# EAGLE design Energy Shield (EAGLE 6.3)
DESCRIPTION: microOBD 200 OBD-II Module; HW_REV: 1.4; PCB_REV: C; PCB_SPEC1: Layer Count: 4; PCB_SPEC2: Size: 1.3" x 0.59"; PCB_SPEC3: Finish Thickness: 0.049" - 0.052"; PCB_SPEC4: Copper Weight: 1oz; TITLE: STM1120
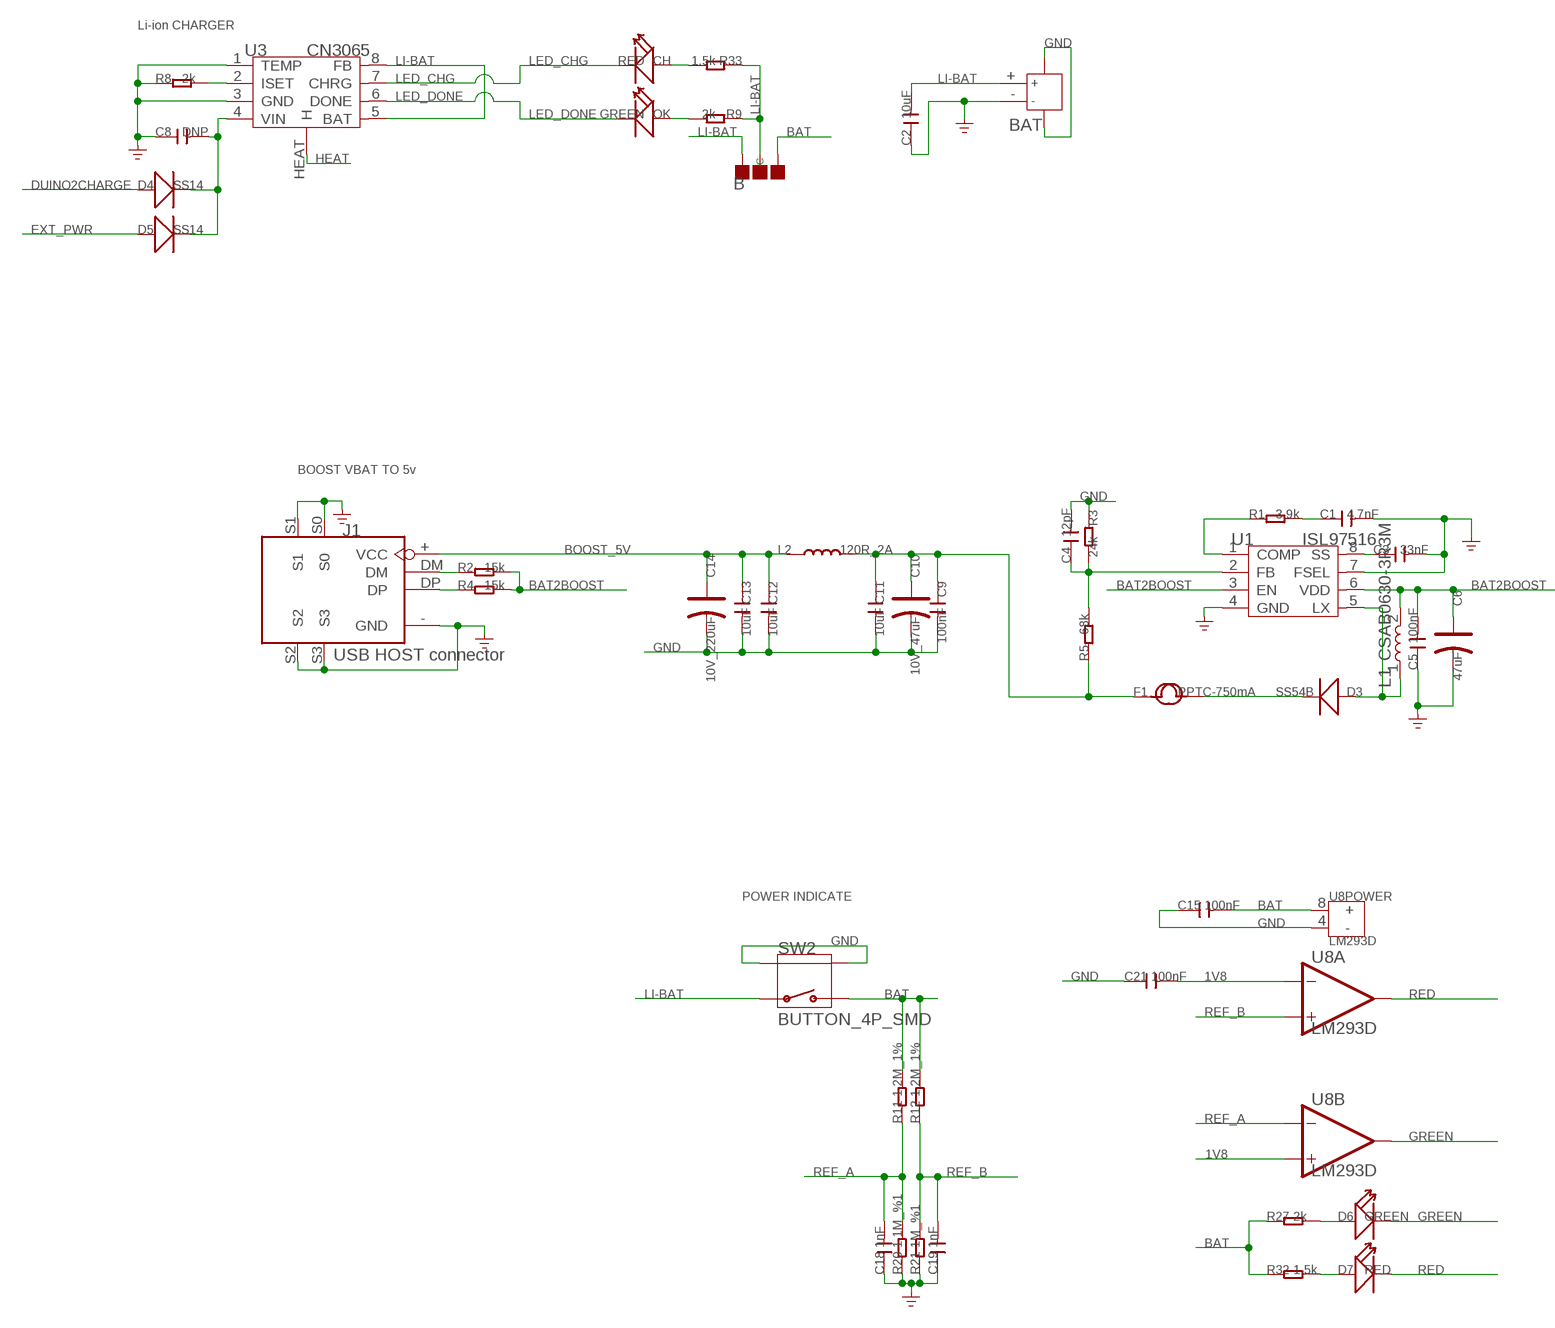
[diagram p0: schematic, sheet 1, part 1 of 2]
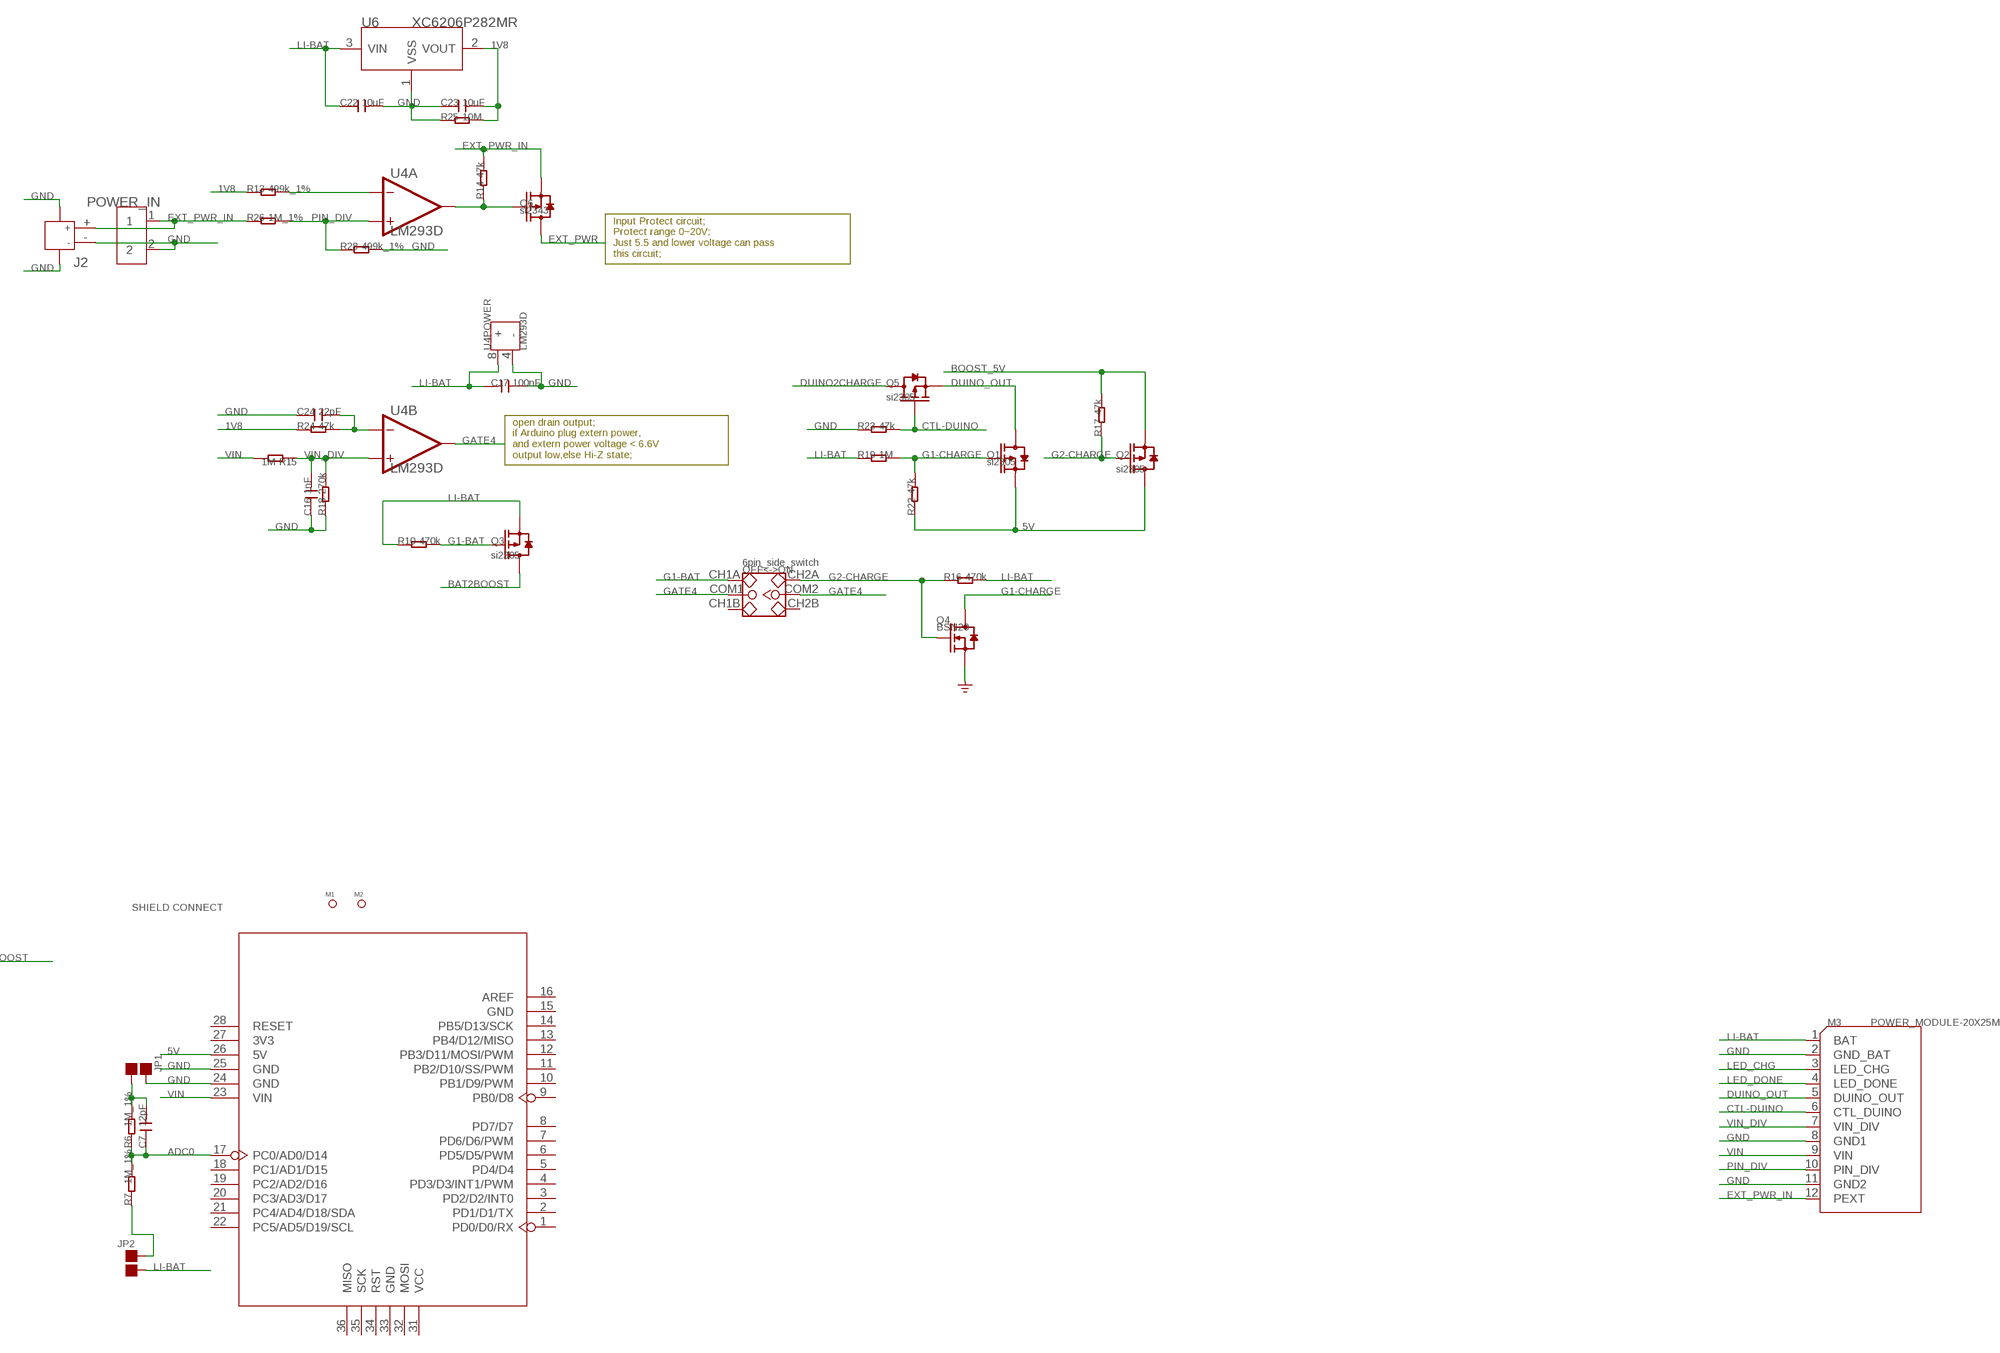
[diagram p1: schematic, sheet 1, part 2 of 2]

## Parts
B  PAD-JUMPER-3P-40*40  [3P-SMD-4.1X1.5]
BAT  JACK-JST-2P-SMD-PW'2.0'  [JST-SMD-2.0-90D]
C1  4.7nF  C-0603  [C0603]
C2  10uF  C-0805  [C0805]
C3  33nF  C-0603  [C0603]
C4  12pF  C-0603  [C0603]
C5  100nF  C-0603  [C0603]
C6  47uF  CAP-AVX-B  [AVX-B]
C7  12pF  C-0603  [C0603]
C8  DNP  C-0805  [C0805]
C9  100nF  C-0603  [C0603]
C10  10V_47uF  CAP-AVX-B  [AVX-B]
C11  10uF  C-0805  [C0805]
C12  10uF  C-0805  [C0805]
C13  10uF  C-0805  [C0805]
C14  10V_220uF  CAP-AVX-D  [AVX-D]
C15  100nF  C-0603  [C0603]
C16  1nF  C-0603  [C0603]
C17  100nF  C-0603  [C0603]
C18  1nF  C-0603  [C0603]
C19  1nF  C-0603  [C0603]
C21  100nF  C-0603  [C0603]
C22  10uF  C-0805  [C0805]
C23  10uF  C-0805  [C0805]
C24  22pF  C-0603  [C0603]
CH  RED  LED'RIGHT'  [LED-SIDE-VIEW-0603-RIGHT]
D3  SS54B  D'MBRS240LT3'  [SMB]
D4  SS14  D'SMA'  [D2010]
D5  SS14  D'SMA'  [D2010]
D6  GREEN  LED'RIGHT'  [LED-SIDE-VIEW-0603-RIGHT]
D7  RED  LED'RIGHT'  [LED-SIDE-VIEW-0603-RIGHT]
F1  PPTC-750mA  FUSE'1210'  [F1210]
J1  USB HOST connector  USB-FEMALE-13.2X14.5  [FEMALE-14.5X13.2]
J2  JACK-JST-2P-SMD-PW'2.0'  [JST-SMD-2.0-90D]
JP1  PAD-JUMPER-2P  [2P-SMD-1.78X1.27]
JP2  PAD-JUMPER-2P  [2P-SMD-1.78X1.27]
L1  CSAB0630-3R3M  L  [L0630]
L2  120R_2A  L'0805'  [L0805]
M1  PAD-MARK  [ROUND-MARK-1.0]
M2  PAD-MARK  [ROUND-MARK-1.0]
M3  POWER_MODULE-20X25MM  [POWER_MODULE]
OFF<->ON  6pin_side_switch  SWITCH-2CH-6P'90D'  [6P-2CH-2.5-9.1X3.5X3.2H-90D]
OK  GREEN  LED'RIGHT'  [LED-SIDE-VIEW-0603-RIGHT]
POWER_IN  SCREW-TERMINAL-2P'3.5'  [2P-3.5]
Q1  si2305  MOSFET-P'SI2323CDS/SI2305DS<BR>'  [SOT23]
Q2  si2305  MOSFET-P'SI2323CDS/SI2305DS<BR>'  [SOT23]
Q3  si2305  MOSFET-P'SI2323CDS/SI2305DS<BR>'  [SOT23]
Q4  BSN20  MOSFET-N'SOT23'  [SOT23]
Q5  si2305  MOSFET-P'SI2323CDS/SI2305DS<BR>'  [SOT23]
Q6  si2343  MOSFET-P'SI2323CDS/SI2305DS<BR>'  [SOT23]
R1  3.9k  R-0603  [R0603]
R2  15k  R-0603  [R0603]
R3  24k  R-0603  [R0603]
R4  15k  R-0603  [R0603]
R5  68k  R-0603  [R0603]
R6  1M_1%  R-0603  [R0603]
R7  1M_1%  R-0603  [R0603]
R8  2k  R-0603  [R0603]
R9  2k  R-0603  [R0603]
R10  470k  R-0603  [R0603]
R11  1.2M_1%  R-0603  [R0603]
R12  1.2M_1%  R-0603  [R0603]
R13  499k_1%  R-0603  [R0603]
R14  47k  R-0603  [R0603]
R15  1M  R-0603  [R0603]
R16  470k  R-0603  [R0603]
R17  47k  R-0603  [R0603]
R18  270k  R-0603  [R0603]
R19  1M  R-0603  [R0603]
R20  1.1M_%1  R-0603  [R0603]
R21  1M_%1  R-0603  [R0603]
R22  47k  R-0603  [R0603]
R23  47k  R-0603  [R0603]
R24  47k  R-0603  [R0603]
R25  10M  R-0603  [R0603]
R26  1M_1%  R-0603  [R0603]
R27  2k  R-0603  [R0603]
R28  499k_1%  R-0603  [R0603]
R32  1.5k  R-0603  [R0603]
R33  1.5k  R-0603  [R0603]
SW2  BUTTON_4P_SMD  [4P-SMD-7X3.5X3.5]
U1  ISL97516  ISL97516-MSOP8  [MSOP8]
U2  ARDUINO'W/O-SILK'  [ARDUINO-W/O-SILK]
U3  CN3065  CN3065-DFN8  [DFN8]
U4  LM293D  LMX93D  [SOIC8-6.0]
U6  XC6206P282MR  XC6206MR  [SOT23]
U8  LM293D  LMX93D  [SOIC8-6.0]

## Nets
1V8: C21.2 C23.2 R13.1 R24.1 R25.2 U6.2(VOUT) U8.2(A:IN-) U8.5(B:IN+)
5V: Q1.2(S) Q2.3(D) R22.1 U2.26(5V)
ADC0: C7.1 R6.1 R7.2 U2.17(PC0/AD0/D14)
BAT: B.00(L) C15.2 R11.2 R12.2 R27.1 R32.1 SW2.2 U8.8(POWER:+)
BAT2BOOST: C5.2 C6.+ L1.2 Q3.3(D) R2.2 R4.2 U1.3(EN) U1.6(VDD)
BOOST_5V: C12.1 C13.1 C14.+ J1.+(VCC) L2.1 Q2.2(S) R17.2
CTL-DUINO: M3.6(CTL_DUINO) Q5.1(G) R23.2
DUINO2CHARGE: D4.+ Q5.3(D)
DUINO_OUT: M3.5(DUINO_OUT) Q1.3(D) Q5.2(S)
EXT_PWR: D5.+ Q6.3(D)
EXT_PWR_IN: J2.+ M3.12(PEXT) POWER_IN.1 Q6.2(S) R14.2 R26.1
G1-BAT: OFF<->ON.CH1A Q3.1(G) R10.2
G1-CHARGE: Q1.1(G) Q4.3(D) R19.2 R22.2
G2-CHARGE: OFF<->ON.CH2A Q2.1(G) Q4.1(G) R16.1 R17.1
GATE4: OFF<->ON.COM1 OFF<->ON.COM2 U4.7(B:OUT)
GND: BAT.3 BAT.4 BAT.- C1.2 C2.1 C3.2 C4.2 C5.1 C6.- C8.1 C9.2 C10.- C11.2 C12.2 C13.2 C14.- C15.1 C16.1 C17.1 C18.1 C19.1 C21.1 C22.2 C23.1 C24.1 J1.-(GND) J1.S0 J1.S1 J1.S2 J1.S3 J2.3 J2.4 J2.- JP1.2 M3.2(GND_BAT) M3.8(GND1) M3.11(GND2) POWER_IN.2 Q4.2(S) R3.1 R8.1 R18.1 R20.1 R21.1 R23.1 R25.1 R28.2 SW2.S1 SW2.S2 U1.4(GND) U1.7(FSEL) U2.24(GND) U2.25(GND) U3.1(TEMP) U3.3(GND) U4.4(POWER:-) U6.1(VSS) U8.4(POWER:-)
GREEN: D6.2(-) U8.7(B:OUT)
HEAT: U3.HEAT(H)
LED_CHG: CH.2(-) M3.3(LED_CHG) U3.7(CHRG)
LED_DONE: M3.4(LED_DONE) OK.2(-) U3.6(DONE)
LI-BAT: B.11(R) B.MM(C) BAT.+ C2.2 C17.2 C22.1 JP2.1 M3.1(BAT) Q3.2(S) R9.1 R10.1 R16.2 R19.1 R33.1 SW2.1 U3.5(BAT) U3.8(FB) U4.8(POWER:+) U6.3(VIN)
N$1: R1.1 U1.1(COMP)
N$2: C1.1 R1.2
N$3: C4.1 R3.2 R5.2 U1.2(FB)
N$4: D3.+ L1.1 U1.5(LX)
N$5: C9.1 C10.+ C11.1 F1.1 L2.2 R5.1
N$6: C3.1 U1.8(SS)
N$7: R8.2 U3.2(ISET)
N$8: Q6.1(G) R14.1 U4.1(A:OUT)
N$9: D6.1(+) R27.2
N$10: OK.1(+) R9.2
N$11: D7.1(+) R32.2
N$12: R13.2 U4.2(A:IN-)
N$13: CH.1(+) R33.2
N$15: J1.DM R2.1
N$16: J1.DP R4.1
N$17: D3.- F1.2
N$22: JP2.2 R7.1
N$27: C7.2 JP1.1 R6.2
P$1: C24.2 R24.2 U4.6(B:IN-)
PIN_DIV: M3.10(PIN_DIV) R26.2 R28.1 U4.3(A:IN+)
RED: D7.2(-) U8.1(A:OUT)
REF_A: C18.2 R11.1 R20.2 U8.6(B:IN-)
REF_B: C19.2 R12.1 R21.2 U8.3(A:IN+)
VCHG_IN: C8.2 D4.- D5.- U3.4(VIN)
VIN: M3.9(VIN) R15.2 U2.23(VIN)
VIN_DIV: C16.2 M3.7(VIN_DIV) R15.1 R18.2 U4.5(B:IN+)
Unconnected: OFF<->ON.CH1B OFF<->ON.CH2B U2.1(PD0/D0/RX) U2.2(PD1/D1/TX) U2.3(PD2/D2/INT0) U2.4(PD3/D3/INT1/PWM) U2.5(PD4/D4) U2.6(PD5/D5/PWM) U2.7(PD6/D6/PWM) U2.8(PD7/D7) U2.9(PB0/D8) U2.10(PB1/D9/PWM) U2.11(PB2/D10/SS/PWM) U2.12(PB3/D11/MOSI/PWM) U2.13(PB4/D12/MISO) U2.14(PB5/D13/SCK) U2.15(GND) U2.16(AREF) U2.18(PC1/AD1/D15) U2.19(PC2/AD2/D16) U2.20(PC3/AD3/D17) U2.21(PC4/AD4/D18/SDA) U2.22(PC5/AD5/D19/SCL) U2.27(3V3) U2.28(RESET) U2.31(VCC) U2.32(MOSI) U2.33(GND) U2.34(RST) U2.35(SCK) U2.36(MISO)

## Notes on the sheet
- Input Protect circuit;
  Protect range 0~20V;
  Just 5.5 and lower voltage can pass
  this circuit;
- open drain output;
  if Arduino plug extern power,
  and extern power voltage < 6.6V
  output low,else Hi-Z state;
- Li-ion CHARGER
- BOOST VBAT TO 5v
- SHIELD CONNECT
- POWER INDICATE

## Library data of the parts
B = Discrete:PAD-JUMPER-3P; PARTNO: DNP
BAT J2 = Connector:JACK-JST-2P-SMD-PW
C1-C5 C7-C9 C11-C13 C15-C19 C21-C24 = Discrete:C*: Ceramic Capacitors
C6 C10 C14 = Discrete:CAP*: Electrolytic Capacitors,Tantalum Capacitors and Super Capacitors
CH D6 D7 OK = Discrete:LED*
D3-D5 = Discrete:D*
F1 = Discrete:FUSE
J1 = Connector:USB-FEMALE
JP1 JP2 = Discrete:PAD-JUMPER-2P; PARTNO: DNP
L1 = template:L*
L2 = Discrete:L*
M1 M2 = Discrete:PAD-MARK; PARTNO: DNP
M3 = For_Test_Albert_v6:POWER_MODULE
OFF<->ON = Discrete:SWITCH-2CH-6P
POWER_IN = Connector:SCREW-TERMINAL-2P
Q1-Q3 Q5 Q6 = Discrete:MOSFET-P
Q4 = Discrete:MOSFET-N: IRLL014: http://www.vishay.com/docs/91319/sihll014.pdf
R1-R28 R32 R33 = Discrete:R*
SW2 = For_Test_Albert_v6:BUTTON_4P_SMD: TS-1188E http://www.best-dz.com/?thread-374-2.html
U1 = IC:ISL97516: 600kHz/1.2MHz PWM Step-Up Regulator http://www.intersil.com/data/fn/fn9261.pdf
U2 = moudle:ARDUINO
U3 = IC:CN3065: USB-Compatible Lithiumt-Ion Battery Charger with Thermal Regulation http://www.consonance-elec.com/pdf/%E6%8A%80%E6%9C%AF%E8%AF%B4%E6%98%8E%E4%B9%A6/DSC-CN3065.pdf
U4 U8 = For_Test_Albert_v6:LMX93: Dual Differential Comparator
U6 = IC:XC6206: LOW ESR Cap.Compatible Positive Voltage Regulators

## Net classes
0 default: width 0.203 mm, drill 0.305 mm, clearance 0.203 mm

## Board
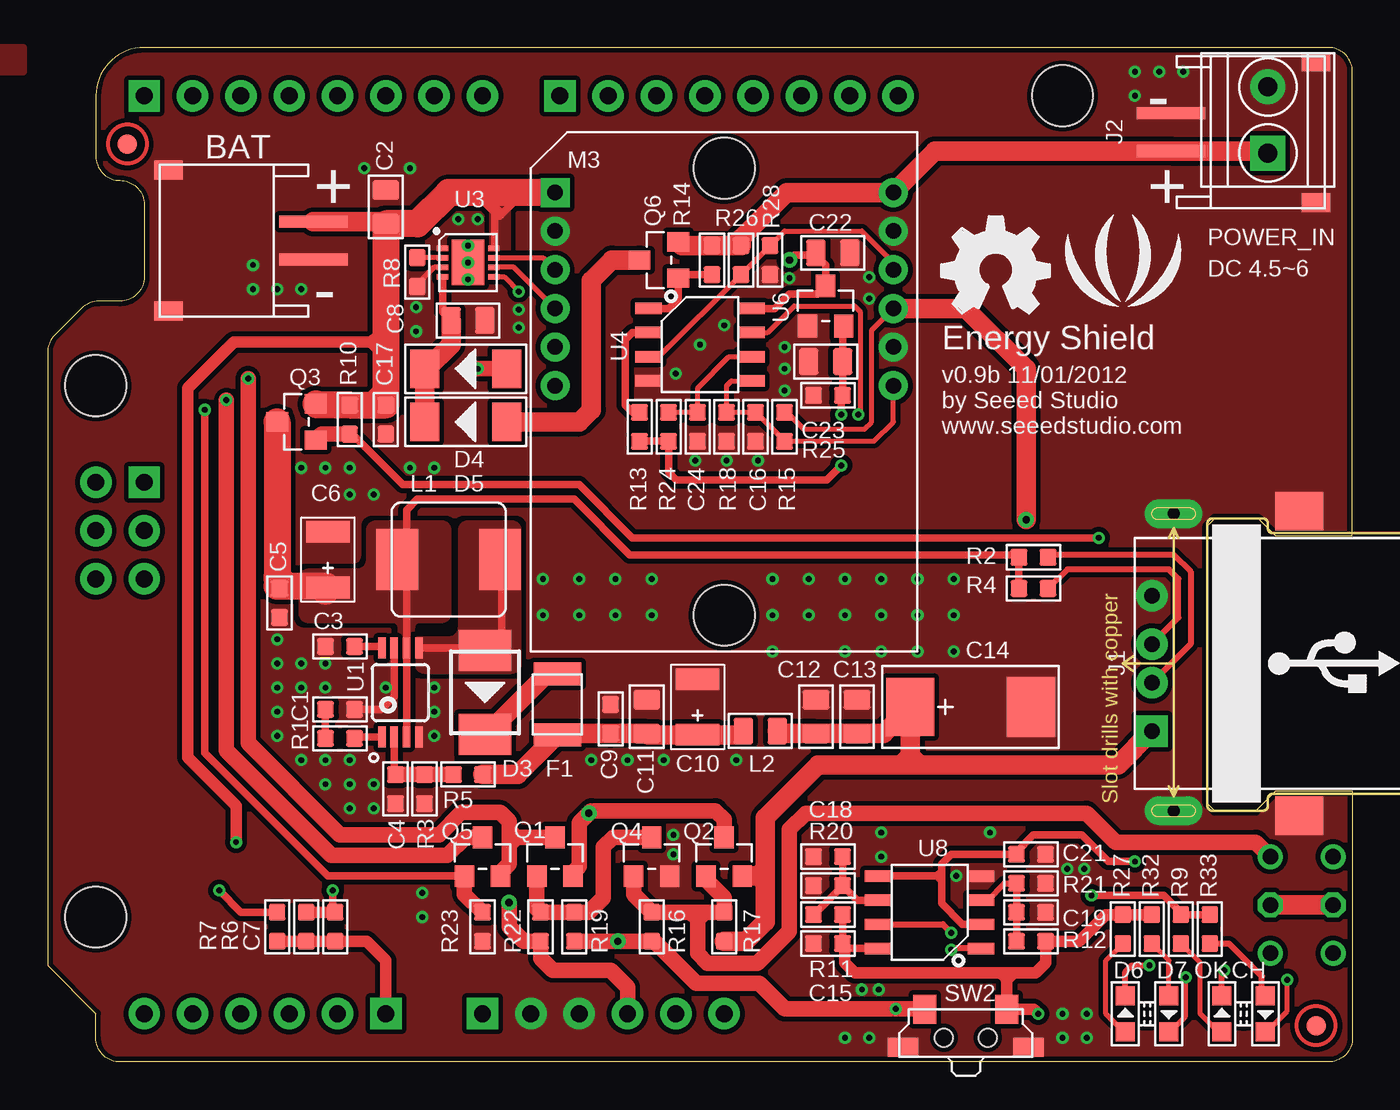
[diagram p2: board, top side]
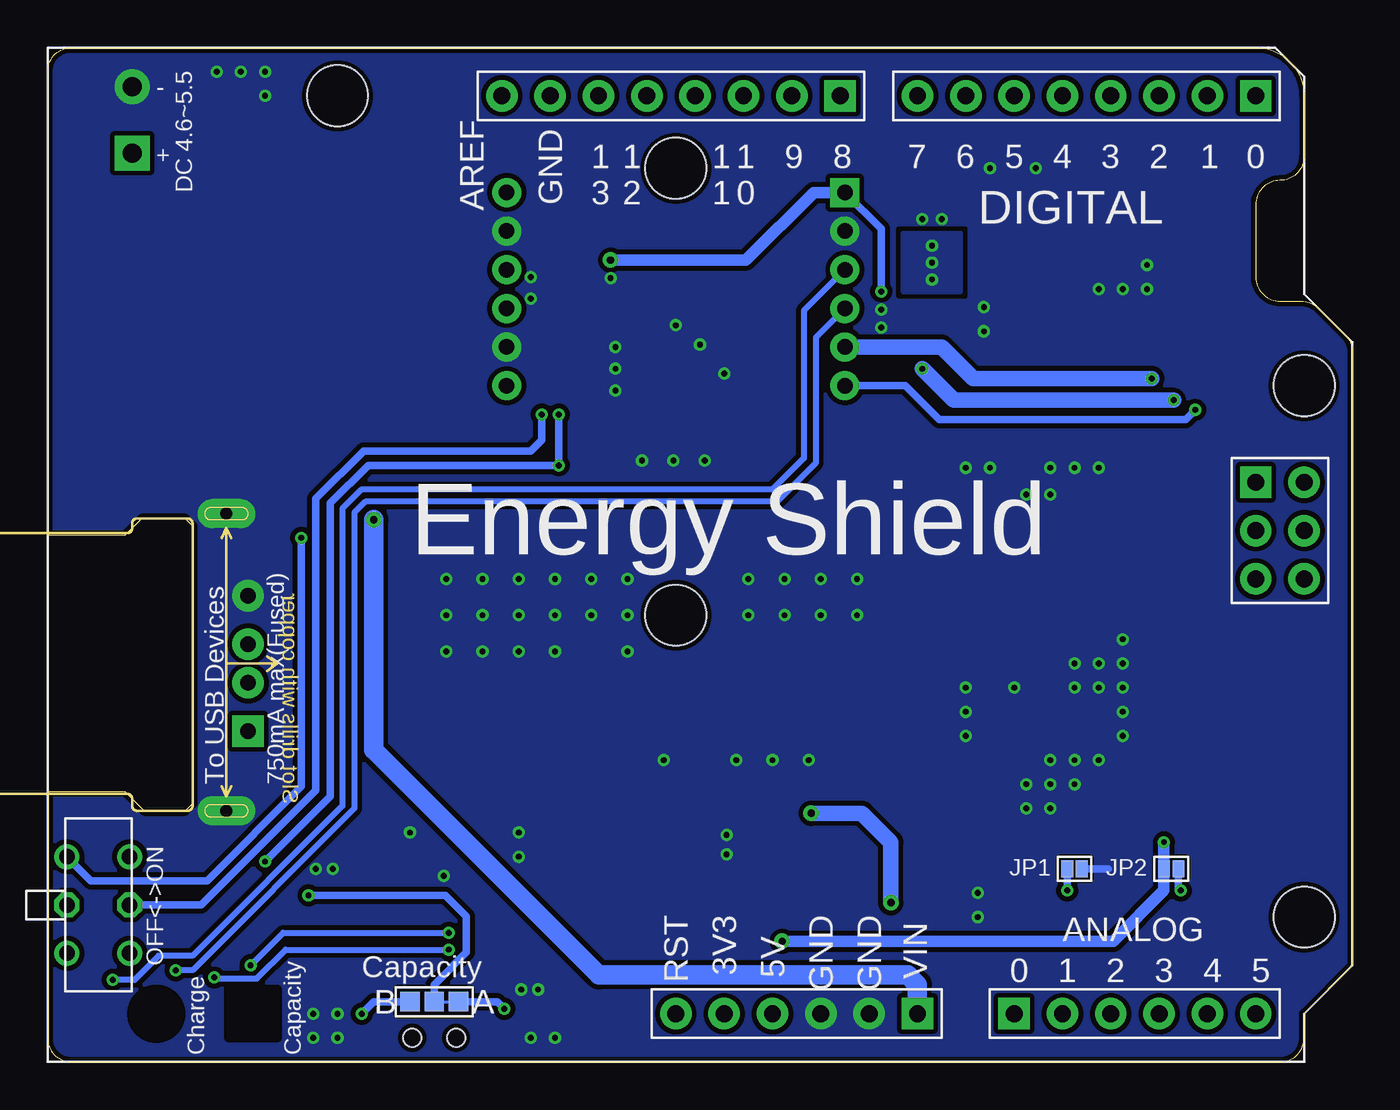
[diagram p3: board, bottom side, seen from below]

Size 68.58 x 53.34 mm. Coordinates in mm from the lower left corner, seen from the top.
Outline: 67.31,0 3.81,0 arc-90 2.54,1.27 2.54,2.54 0,5.08 0,37.32 arc-45 0.37,38.22 1.79,39.63 arc-45 2.69,40.01 3.81,40.01 arc90 5.08,41.27 5.08,45.09 arc90 3.81,46.35 arc-90 2.54,47.62 2.54,50.8 arc-90 5.08,53.34 67.31,53.34 arc-90 68.58,52.07 68.58,27.69 64.52,27.69 63.63,28.57 61.34,28.57 60.96,28.19 60.96,13.59 61.34,13.21 63.5,13.21 64.52,14.22 68.58,14.22 68.58,1.27 arc-90 67.31,0
Copper layers (1*16): Top 0.035mm / dielectric 1.5mm / Bottom 0.035mm
Design rules "default": minimum track width 6mil, minimum drill 12mil, track to track 6mil, track to pad 6mil, pad to pad 6mil, via to via 6mil, smd to smd 0mil, copper to edge 10mil, drill to drill 10mil, minimum pad ring 10mil, minimum via ring 6mil, stop-mask expansion 2mil, vias tented up to drill 100mil, thermal gap 10mil
tKeepout: 8 lines
tRestrict: area 57.1,1.9 to 58.4,3.2; area 62.2,1.9 to 63.5,3.2
bRestrict: area 56.5,1.3 to 59.1,3.8; area 61.6,1.3 to 64.1,3.8

### Footprints (pad centres in the part's own frame; a part is rotated, then mirrored left to right if it is on the bottom)
3P-SMD-4.1X1.5 = smd 1.016 x 1.016: 00 -1.27,0; 11 1.27,0; MM 0,0
JST-SMD-2.0-90D = smd 1 x 1.5: 3 3.7,-2.54; 4 -3.7,-2.54 | smd 0.635 x 3.6: + -1,5.08; - 1,5.08
C0603 = smd 0.889 x 0.889: 1 -0.762,0; 2 0.762,0
C0805 = smd 1.016 x 1.397: 1 -0.889,0; 2 0.889,0
AVX-B = smd 1.143 x 2.286: + -1.46,0; - 1.46,0
AVX-D = smd 2.54 x 3.048: + -3.175,0 | smd 2.54 x 3.175: - 3.175,0
LED-SIDE-VIEW-0603-RIGHT = smd 1 x 1: 1 0,-0.95; 2 0,0.95
SMB = smd 2.159 x 2.743: + -2.21,0; - 2.21,0
D2010 = smd 1.524 x 2.032: + -2.159,0; - 2.159,0
F1210 = smd 1.2 x 2.5: 1 -1.6,0; 2 1.6,0
FEMALE-14.5X13.2 = drill 0.813 pad 1.651 square: + 0.889,-3.556 | drill 0.813 pad 1.651: - 0.889,3.556; DM 0.889,-1.016; DP 0.889,1.016 | smd 2.54 x 2.032: S0 8.636,8.001; S3 8.636,-8.001 | drill 0.635 pad 1.524 long: S1 2.032,7.874; S2 2.032,-7.747
2P-SMD-1.78X1.27 = smd 0.889 x 0.61: 1 0,0.381; 2 0,-0.381
L0630 = smd 2.2 x 3.2: 1 -2.7,0; 2 2.7,0
L0805 = smd 1.016 x 1.397: 1 -0.889,0; 2 0.889,0
ROUND-MARK-1.0 = smd 1.016 x 1.016: P$1 0,0
POWER_MODULE = drill 0.813 pad 1.524 square: 1 -10.795,-8.89 | drill 0.813 pad 1.524: 2 -8.763,-8.89; 3 -6.731,-8.89; 4 -4.699,-8.89; 5 -2.667,-8.89; 6 -0.635,-8.89; 7 -0.635,8.89; 8 -2.667,8.89; 9 -4.699,8.89; 10 -6.731,8.89; 11 -8.763,8.89; 12 -10.795,8.89 | hole 3.2: -12.065,0; 11.43,0
6P-2CH-2.5-9.1X3.5X3.2H-90D = drill 0.813 pad 1.27: CH1A -2.54,-1.65; CH1B 2.54,-1.65; CH2A -2.54,1.65; CH2B 2.54,1.65 | drill 0.813 pad 1.27 octagon: COM1 0,-1.65; COM2 0,1.65
2P-3.5 = drill 1 pad 1.85 square: 1 -1.75,0 | drill 1 pad 1.85: 2 1.75,0
SOT23 = smd 1.016 x 1.143: 1 -0.95,-1.016; 2 0.95,-1.016; 3 0,1.016
R0603 = smd 0.889 x 0.889: 1 -0.762,0; 2 0.762,0
4P-SMD-7X3.5X3.5 = smd 1.2 x 1.5: 1 -2.15,1.5; 2 2.15,1.5 | smd 1.6 x 1: S1 -3.3,-0.5; S2 3.3,-0.5 | hole 0.95: -1.15,0; 1.15,0
MSOP8 = smd 0.4 x 1.1: 1 -0.975,-2.35; 2 -0.325,-2.35; 3 0.325,-2.35; 4 0.975,-2.35; 5 0.975,2.35; 6 0.325,2.35; 7 -0.325,2.35; 8 -0.975,2.35
ARDUINO-W/O-SILK = drill 0.889 pad 1.651 square: 1 63.5,50.8; 9 41.656,50.8; 17 50.8,2.54; 23 45.72,2.54; 36 63.5,30.48 | drill 0.889 pad 1.651: 2 60.96,50.8; 3 58.42,50.8; 4 55.88,50.8; 5 53.34,50.8; 6 50.8,50.8; 7 48.26,50.8; 8 45.72,50.8; 10 39.116,50.8; 11 36.576,50.8; 12 34.036,50.8; 13 31.496,50.8; 14 28.956,50.8; 15 26.416,50.8; 16 23.876,50.8; 18 53.34,2.54; 19 55.88,2.54; 20 58.42,2.54; 21 60.96,2.54; 22 63.5,2.54; 24 43.18,2.54; 25 40.64,2.54; 26 38.1,2.54; 27 35.56,2.54; 28 33.02,2.54; 31 66.04,30.48; 32 66.04,27.94; 33 66.04,25.4; 34 63.5,25.4; 35 63.5,27.94 | hole 3.2: 15.24,50.8; 66.04,35.56; 66.04,7.62
DFN8 = smd 0.3 x 0.6: 1 -0.75,-1.35; 2 -0.25,-1.35; 3 0.25,-1.35; 4 0.75,-1.35; 5 0.75,1.35; 6 0.25,1.35; 7 -0.25,1.35; 8 -0.75,1.35 | smd 2.4 x 1.7: HEAT 0,0
SOIC8-6.0 = smd 0.6 x 1.4: 1 -1.905,-2.7; 2 -0.635,-2.7; 3 0.635,-2.7; 4 1.905,-2.7; 5 1.905,2.7; 6 0.635,2.7; 7 -0.635,2.7; 8 -1.905,2.7
SOT23' = smd 1.016 x 1.2: 1 -0.95,-1.06; 2 0.95,-1.06; 3 0,1.06

### Placement (x,y rotation side)
B  48.26,3.17 0 bottom
BAT  8.89,43.18 270 top
C1  15.37,18.54 0 top
C2  17.78,44.96 270 top
C3  15.37,21.84 180 top
C4  18.29,14.35 270 top
C5  12.19,24.13 90 top
C6  14.73,26.42 90 top
C7  15.11,7.11 90 top
C8  22.1,38.99 180 top
C9  29.59,18.03 90 top
C10  34.16,18.67 90 top
C11  31.5,18.16 90 top
C12  40.39,18.16 90 top
C13  42.55,18.16 90 top
C14  48.51,18.67 0 top
C15  41.02,6.22 0 top
C16  37.21,33.4 90 top
C17  17.78,33.78 90 top
C18  41.02,10.79 0 top
C19  51.69,7.87 180 top
C21  51.69,10.92 180 top
C22  41.27,42.55 0 top
C23  40.89,36.83 0 top
C24  34.16,33.4 90 top
CH  64.01,2.54 180 top
D3  22.99,19.43 270 top
D4  21.97,36.45 180 top
D5  21.97,33.66 180 top
D6  56.64,2.54 0 top
D7  58.93,2.54 180 top
F1  26.8,18.8 90 top
J1  57.15,20.95 0 top
J2  64.14,48.9 90 top
JP1  14.61,10.16 90 bottom
JP2  9.53,10.16 90 bottom
L1  21.08,26.42 180 top
L2  37.47,17.4 180 top
M1  4.19,48.26 0 top
M2  66.67,1.91 0 top
M3  35.56,34.92 270 top
OFF<->ON  65.91,8.26 270 bottom
OK  61.72,2.54 0 top
POWER_IN  64.14,49.53 90 top
Q1  26.67,10.79 0 top
Q2  35.56,10.79 0 top
Q3  13.08,33.66 90 top
Q4  31.75,10.79 0 top
Q5  22.86,10.79 0 top
Q6  32.13,42.16 90 top
R1  15.37,17.02 180 top
R2  51.82,26.54 180 top
R3  19.81,14.35 90 top
R4  51.82,24.89 180 top
R5  22.1,15.11 180 top
R6  13.59,7.11 90 top
R7  12.06,7.11 270 top
R8  19.43,41.53 90 top
R9  59.56,6.99 270 top
R10  15.88,33.78 270 top
R11  41.02,7.75 0 top
R12  51.69,6.35 0 top
R13  31.11,33.4 90 top
R14  34.92,42.16 90 top
R15  38.73,33.4 90 top
R16  31.75,7.11 270 top
R17  35.56,7.11 270 top
R18  35.69,33.4 90 top
R19  27.69,7.11 90 top
R20  41.02,9.27 0 top
R21  51.69,9.4 180 top
R22  25.91,7.11 90 top
R23  22.86,7.11 90 top
R24  32.64,33.4 90 top
R25  41.02,35.05 0 top
R26  36.45,42.16 270 top
R27  56.52,6.99 270 top
R28  37.97,42.16 270 top
R32  58.04,6.99 270 top
R33  61.09,6.99 270 top
SW2  48.26,1.27 0 top
U1  18.54,19.43 0 top
U2  68.58,0 0 bottom
U3  22.1,42.04 270 top
U4  34.29,37.72 270 top
U6  XC6206P282MR  [SOT23']  40.89,39.75 0 top
U8  46.35,7.87 90 top
U$17  [OSHW_FILLX200_NOTEXT]  46.99,39.37 0 top
U$18  [LOGO_SILK]  56.52,41.4 0 top

### Tracks (layer width: path | path; a pad name or v marks a point on that pad's centre or on a via)
1V8  (via drill 0.3 pad 0.64)
  Top 0.406: U8.2 48.08,7.24 46.99,8.33 46.99,9.53 | R13.1 R24.1 32.64,31.01 33.04,30.61 40.96,30.61 v41.72,31.37 | 46.99,9.53 46.99,9.65 | 46.99,9.65 46.99,10.03 | 46.99,10.03 46.99,10.41 47.5,10.92 C21.2 50.93,11.05 51.82,11.94 54.36,11.94 55.75,10.54 v57.15,10.54 | U8.5 46.74,9.78 | 46.74,9.78 46.86,9.78 46.99,9.65 | 46.74,9.78 46.99,10.03 | 46.74,9.78 46.99,9.53 | U6.2 41.78,38.63 C23.2 R25.2 41.72,34.99 v41.72,34.04
  Bottom 0.406: v41.72,34.04 v41.72,31.37 51.74,31.37 53.72,29.39 53.72,13.97 v57.15,10.54
5V  (via drill 0.38 pad 0.81)
  Top 0.813: Q1.2 27.62,9.97 27.94,10.29 27.94,12.57 v28.45,13.08 28.57,13.21 35.1,13.21 35.56,12.75 Q2.3 | U2.26 30.48,3.94 29.59,4.83 26.54,4.83 25.91,5.46 R22.1 25.02,6.35 24.26,7.11 v24.26,8.38
  Bottom 0.813: v24.26,8.38 24.26,11.56 25.78,13.08 v28.45,13.08
ADC0
  Top 0.61: R7.2 R6.1 C7.1 16.76,6.35 17.78,5.33 U2.17
BAT  (via drill 0.3 pad 0.64)
  Top 0.406: U8.8 42.04,5.97 C15.2 R11.2 | 50.81,3.17 SW2.2
  Top 0.61: 50.41,4.31 SW2.2 51.84,2.77 v52.07,2.54 | 50.41,4.33 50.41,4.69 | C15.2 41.91,6.1 41.91,5.21 42.43,4.69 50.41,4.69 | 50.41,4.69 51.93,4.69 52.45,5.21 R12.2 54.23,6.35 55.63,7.75 R27.1 R32.1 | 50.41,4.31 50.41,4.33 | 50.41,4.33 50.16,4.57 | 50.41,4.31 50.67,4.57
  Bottom 0.406: B.00 51.44,3.17 v52.07,2.54
BAT2BOOST
  Top 0.406: U1.3 U1.6 18.87,29.03 19.43,29.59 27.69,29.59 30.61,26.67 50.93,26.67 R2.2 R4.2 | 18.41,26.45 L1.2
  Top 1.016: C5.2 12.19,25.27 12.06,25.4
  Top 1.422: 14.48,24.89 14.61,24.77 | Q3.3 12.06,25.53 | 12.06,25.53 12.06,25.4 12.06,25.02 12.57,25.02 | 12.57,25.02 14.67,25.02 C6.+ | 12.06,25.53 12.57,25.02
  pour Top (isolate 0.254, rank 2, no thermals): 18.54,21.34 19.18,21.34 19.18,22.86 arc-90 19.56,23.24 20.7,23.24 arc90 21.08,23.62 21.08,27.94 arc90 20.7,28.32 17.27,28.32 arc90 16.89,27.94 16.89,26.42 arc-90 16.26,25.78 13.72,25.78 arc90 13.34,25.4 13.34,23.62 arc90 13.72,23.24 18.16,23.24 arc-90 18.54,22.86
BOOST_5V
  Top 1.016: L2.1 38.48,17.27 C12.1 C13.1 43.94,17.27 C14.+ 45.34,16.13 | R17.2 36.7,6.35 37.72,7.37 37.72,9.4 | 37.72,9.4 37.72,9.91 | 37.72,9.91 37.72,12.82 40.52,15.62 44.83,15.62 | 44.83,15.62 45.72,15.62 | 45.72,15.62 45.85,15.62 | 45.34,16.13 45.34,16 45.72,15.62 | 45.34,16.13 44.83,15.62 | 45.34,16.13 45.85,15.62 | Q2.2 37.34,9.78 | 37.34,9.78 37.59,9.78 37.72,9.91 | 37.34,9.78 37.59,10.03 | 37.34,9.78 37.72,9.4 | 45.85,15.62 56.26,15.62 J1.+
CTL-DUINO  (via drill 0.3 pad 0.64)
  Top 0.406: Q5.1 14.73,9.78 8.26,16.26 v8.26,34.29
  Top 0.813: Q5.1 21.91,8.82 R23.2
  Bottom 0.406: v8.26,34.29 8.76,33.78 21.72,33.78 23.5,35.56 M3.6
DUINO2CHARGE  (via drill 0.3 pad 0.64)
  Top 0.813: Q5.3 21.97,11.81 21.02,10.86 14.92,10.86 9.4,16.38 v9.4,34.8 | v22.61,36.45 D4.+
  Bottom 0.813: v9.4,34.8 20.95,34.8 v22.61,36.45
DUINO_OUT  (via drill 0.3 pad 0.64)
  Top 0.813: Q5.2 23.81,9.97 24.26,10.41 24.26,11.81 | 24.26,11.81 24.26,12.19 | 24.26,12.19 24.26,12.66 23.8,13.12 21.75,13.12 20.57,11.94 15.37,11.94 10.54,16.76 v10.54,35.94 | Q1.3 24.64,11.81 | 24.64,11.81 24.26,11.81 | 24.64,11.81 24.26,12.19 | 24.64,11.81 24.38,11.56
  Bottom 0.813: v10.54,35.94 19.94,35.94 21.59,37.59 M3.5
EXT_PWR
  Top 1.016: Q6.3 29.65,42.16 28.57,41.09 28.57,34.29 27.94,33.66 D5.+
EXT_PWR_IN
  Top 0.406: R26.1 36.45,43.05
  Top 1.016: POWER_IN.1 64.02,47.9 J2.+ 46.62,47.9 M3.12 38.86,45.72 36.45,43.31 | 36.45,43.31 R26.1 R14.2 33.34,42.93 Q6.2 | 36.45,43.31 36.2,43.05
G1-BAT  (via drill 0.3 pad 0.64)
  Top 0.406: 15.88,32.89 R10.2 16,33.02 18.67,30.35 27.94,30.35 30.73,27.56 v55.24,27.56
  Top 0.813: R10.2 14.41,33.02 Q3.1
  Bottom 0.406: v55.24,27.56 55.24,14.48 60.19,9.53 66.29,9.53 | 66.29,9.53 | 66.29,9.53 66.3,9.53 OFF<->ON.CH1A
G1-CHARGE
  Top 0.813: Q1.1 25.72,8.06 R22.2 R19.2 28.45,7.87 29.21,8.64 29.21,11.3 29.72,11.81 Q4.3
G2-CHARGE
  Top 0.813: Q4.1 30.8,8.82 R16.1 33.78,7.87 | Q2.1 34.61,9.59 35.56,8.64 R17.1 34.04,7.87 | 34.04,7.87 33.78,7.87 | 34.16,7.49 34.16,5.71 34.68,5.2 37.3,5.2 38.99,6.88 38.99,12.23 39.84,13.08 54.61,13.08 56.13,11.56 63.5,11.56 OFF<->ON.CH2A | 34.16,7.49 34.16,7.75 34.04,7.87 | 34.16,7.49 33.78,7.87 | 34.16,7.49 34.42,7.75
GATE4  (via drill 0.3 pad 0.64)
  Top 0.254: U4.7 37.85,38.35 39.24,39.75 42.42,39.75 42.7,39.46 42.7,34.13 v42.61,34.04
  Top 1.016: OFF<->ON.COM2 OFF<->ON.COM1
  Bottom 0.406: OFF<->ON.COM2 60.51,8.26 54.48,14.28 54.48,29.62 51.97,32.13 43.18,32.13 42.61,32.7 v42.61,34.04
GND  (via drill 0.3 pad 0.64)
  Top 0.254: U3.3 20.32,41.79 19.43,40.89 R8.1
  Top 0.406: U1.7 18.22,19.23 17.53,18.54 C1.2
  Bottom 0.406: JP1.2 12.83,10.16
  other vias: 34.04,31.62 35.69,31.62 37.34,31.62 38.73,36.45 38.73,37.59 38.73,35.31 38.99,41.21 16.64,46.99 19.05,46.99 19.37,39.69 19.37,38.42 24.77,38.61 24.77,39.56 13.34,31.24 14.61,31.24 15.88,31.24 15.88,29.84 17.14,29.84 12.06,22.23 12.06,20.95 12.06,19.68 13.34,19.68 13.34,20.95 14.61,20.95 14.61,19.68 12.06,18.41 12.06,17.14 14.61,15.88 13.34,15.88 15.88,15.88 15.88,14.61 15.88,13.34 14.61,14.61 17.14,14.61 17.14,13.34 20.32,17.14 20.32,18.41 20.32,19.68 17.78,19.68 26.04,25.4 26.04,23.5 27.94,25.4 27.94,23.5 29.84,23.5 29.84,25.4 31.75,25.4 31.75,23.5 38.1,25.4 40.01,25.4 41.91,25.4 43.81,25.4 45.72,25.4 47.62,25.4 47.62,23.5 47.62,21.59 45.72,21.59 45.72,23.5 43.81,23.5 43.81,21.59 41.91,21.59 41.91,23.5 40.01,23.5 38.1,23.5 38.1,21.59 30.48,15.88 32.38,15.88 28.57,15.88 43.81,12.06 43.81,10.79 53.59,10.16 42.8,3.81 43.69,3.81 32.89,11.94 32.89,10.92 19.68,8.89 19.68,7.62 47.75,9.78 43.18,41.27 43.18,40.13 21.59,44.32 22.61,44.32 35.56,38.73 43.18,1.27 41.91,1.27 53.34,1.27 54.61,1.27 54.61,2.54 53.34,2.54 36.2,15.88 10.79,41.91 10.79,40.64 12.06,40.64 13.34,40.64 59.69,52.07 58.42,52.07 57.15,52.07 57.15,50.8 19.05,31.24 20.32,31.24 33.02,36.2 34.29,37.72 54.48,10.16 49.53,12.06
  pour Top (isolate 0.406, rank 6, no thermals): -1.27,53.34 -2.54,53.34 -2.54,52.07 -1.27,52.07
  pour Top (isolate 0.254, rank 6, no thermals): 0.25,0 68.58,0 68.58,53.34 0,53.34 0,0
  pour Bottom (isolate 0.254, rank 6, no thermals): 0.25,0 68.58,0 68.58,53.34 0,53.34 0,0
GREEN  (via drill 0.3 pad 0.64)
  Top 0.305: D6.2 56.64,4.75 56.97,5.08 v57.91,5.08 | U8.7 47.05,7.24 v47.5,6.79
  Bottom 0.305: v57.91,5.08 56.2,6.79 v47.5,6.79
HEAT  (via drill 0.3 pad 0.64)
  other vias: 22.1,41.15 22.1,42.04 22.1,42.93
  pour Bottom: 23.62,40.51 20.57,40.51 20.57,43.56 23.62,43.56
LED_CHG  (via drill 0.3 pad 0.64)
  Top 0.254: U3.7 26.04,42.29 M3.3 | CH.2 64.07,1.59 65.15,2.67 v65.15,4.32
  Bottom 0.305: v65.15,4.32 64.01,4.32 62.74,5.59 60.96,5.59 53.09,13.46 53.09,29.11 52.09,30.1 30.48,30.1 28.83,31.75 28.83,39.5 M3.3
LED_DONE  (via drill 0.3 pad 0.64)
  Top 0.254: M3.4 24.51,41.79 U3.6
  Top 0.305: OK.2 61.72,4.7 v61.85,4.83
  Bottom 0.305: M3.4 28.19,38.1 28.19,31.5 30.23,29.46 51.88,29.46 52.45,28.9 52.45,13.34 60.96,4.83 v61.85,4.83
LI-BAT  (via drill 0.3 pad 0.64, 0.38 pad 0.81)
  Top 0.254: U3.8 23.45,42.82 23.5,42.86 | U3.5 23.99,41.29 v24.77,40.51
  Top 0.406: 23.5,42.86 23.5,44.58 | 23.5,44.58 23.5,45.59 23.37,45.72 | 23.5,44.58 23.75,44.58 23.88,44.58 24.64,45.34 | U4.8 38.23,39.62 38.99,40.39 40.47,40.39 U6.3 40.89,41.91 40.39,42.42 | C22.1 40.39,42.42 | 40.39,42.42 39.24,42.42 v38.99,42.16 | 58.8,8.64 59.56,7.87 R9.1 R33.1 | 58.8,8.64 | 58.8,8.64 58.67,8.76 v54.86,8.76
  Top 0.61: 17.78,38.1 17.53,37.85 17.02,37.85 | 17.02,37.85 9.78,37.85 7.37,35.43 7.37,16 9.91,13.46 v9.91,11.56 | 23.75,44.58 22.99,45.34 | 17.02,37.85 17.4,38.23 | 17.02,37.85 17.53,37.34
  Top 0.813: R19.1 v29.97,6.35 R16.2 31.88,6.35 34.1,4.13 37.4,4.13 38.73,2.79 v44.58,2.79 46.09,2.79 SW2.1
  Top 1.016: BAT.+ 17.78,44.18 C2.2
  Top 1.422: 17.14,34.54 R10.1 14.16,34.54 Q3.2 | 17.14,34.54 C17.2 17.78,38.1 C2.2 19.43,44.07 21.08,45.72 23.37,45.72 M3.1 | 17.14,34.54 17.65,35.05
  Bottom 0.152: B.MM B.11
  Bottom 0.406: v24.77,40.51 24.77,43.81 M3.1 | v54.86,8.76 47.69,8.76 46.57,7.65 46.57,5.75 48.26,4.06 B.MM | B.11 44.96,3.17 v44.58,2.79
  Bottom 0.61: v38.99,42.16 31.88,42.16 28.32,45.72 M3.1 | v29.97,6.35 12.57,6.35 9.91,9.02 JP2.1 v9.91,11.56
  pour Top (isolate 0.254, no thermals): 23.3,42.74 24.26,42.74 24.26,45.72 23.3,45.72
N$1
  Top 0.406: U1.1 16.19,17.08 R1.1
N$2
  Top 0.406: R1.2 C1.1
N$3
  Top 0.406: U1.2 18.22,15.18 C4.1
  Top 0.813: R5.2 R3.2 C4.1
N$4
  Top 0.406: U1.5 22.85,21.78 D3.+ 23.67,21.64 23.88,21.84 23.88,26.39
  pour Top (isolate 0.254, no thermals): 19.43,22.23 19.43,20.95 arc90 19.81,20.57 24.38,20.57 arc90 24.77,20.95 24.77,27.94 arc90 24.38,28.32 22.1,28.32 arc90 21.72,27.94 21.72,22.86 arc-90 21.08,22.23
N$5
  Top 1.016: L2.2 36.39,17.21 C10.+ 31.56,17.21 C11.1 C9.1 26.87,17.27 F1.1 24.71,15.11 R5.1
N$6
  Top 0.406: C3.1 17.5,21.84 U1.8
N$7
  Top 0.254: U3.2 R8.2
N$8
  Top 0.406: R14.1 33.34,41.4 Q6.1 33.15,40.13 32.64,39.62 U4.1
N$9
  Top 0.254: 56.64,1.65 56.52,1.65 55.63,2.54 55.63,5.33 R27.2
  Top 0.305: D6.1 56.64,1.65
N$10
  Top 0.254: OK.1 61.53,1.59 60.58,2.54 60.58,5.21 R9.2
N$11
  Top 0.254: D7.1 58.93,5.33 R32.2
N$12
  Top 0.406: U4.2 30.73,38.35 30.35,37.97 30.35,34.54 30.73,34.16 R13.2
N$13
  Top 0.254: CH.1 63.82,3.49
  Top 0.305: 63.82,3.49 63.82,4.51 62.1,6.22 R33.2
N$15
  Top 0.305: J1.DM 60.07,21.97 60.07,25.78 59.18,26.67 52.7,26.67 R2.1
N$16
  Top 0.305: J1.DP 59.44,23.37 59.44,25.4 58.93,25.91 53.59,25.91 R4.1
N$17
  Top 1.016: D3.- 23.06,17.22 26.24,20.4 F1.2
N$22  (via drill 0.3 pad 0.64)
  Top 0.406: R7.1 10.16,7.87 v9.02,9.02
  Bottom 0.406: JP2.2 9.14,9.14 v9.02,9.02
N$27  (via drill 0.3 pad 0.64)
  Top 0.406: v14.99,9.02 14.99,8 C7.2
  Top 0.61: R6.2 C7.2
  Bottom 0.406: v14.99,9.02 JP1.1
P$1
  Top 0.254: R24.2 C24.2 34.16,35.43 35.81,37.08 U4.6
PIN_DIV
  Top 0.254: U4.3 32.13,37.08 R26.2 R28.1 38.73,43.69 42.8,43.69 44.45,42.04 M3.10
RED  (via drill 0.3 pad 0.64)
  Top 0.254: D7.2 58.99,1.59 59.82,2.41 v59.82,4.45
  Top 0.305: U8.1 47.56,5.97 v47.5,5.91
  Bottom 0.305: v59.82,4.45 59.77,4.39 57.58,4.39 56.07,5.91 v47.5,5.91
REF_A
  Top 0.406: R11.1 R20.2 | R20.2 C18.2 | U8.6 42.55,8.51 R20.2
REF_B
  Top 0.305: U8.3 49.4,8.51 50.29,9.4 R21.2
  Top 0.406: R21.2 C19.2 R12.1
VCHG_IN
  Top 0.254: C8.2 21.21,39.24 | U3.4 20.75,41.16 20.77,41.15
  Top 0.406: 20.77,41.15 20.77,39.43 C8.2
  Top 1.016: C8.2 21.21,37.72 19.94,36.45 D4.- D5.-
VIN  (via drill 0.38 pad 0.81)
  Top 0.254: R15.2 38.86,34.16 39.75,33.27 42.93,33.27 43.31,33.66 43.31,38.48 M3.9
  Top 1.016: v51.44,28.51 51.44,36.45 48.26,39.62 M3.9
  Bottom 1.016: U2.23 22.86,4.06 23.37,4.57 39.6,4.57 51.44,16.4 v51.44,28.51
VIN_DIV
  Top 0.254: M3.7 44.45,33.66 43.43,32.64 R15.1 C16.2 R18.2 35.69,35.56 35.94,35.81 U4.5

### Text on the board
tPlace: - | + | + | DC 4.5~6 | - | Energy Shield | v0.9b 11/01/2012 / by Seeed Studio / www.seeedstudio.com
bPlace: - | 0 | 1 | 2 | 3 | 4 | 5 | 6 | 7 | 8 | 9 | 1 | 1 | 1 | 1 | + | DC 4.6~5.5 | 0 | 1 | 2 | 3 | GND | AREF | DIGITAL | Energy Shield | 750mA max(Fused) | To USB Devices | GND | GND | 3V3 | RST | VIN | 5V | ANALOG | 5 | 4 | 3 | 2 | 1 | 0 | Capacity | A | Capacity | Charge